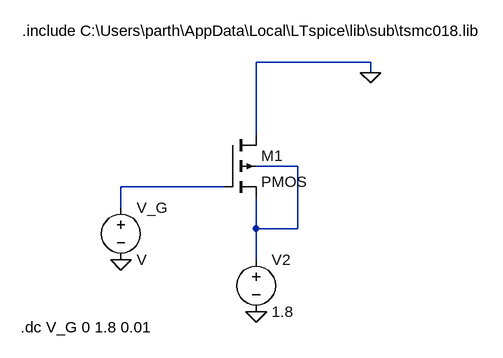
[diagram p0: schematic Part-A - a).asc]
Part-A - a).asc, the LTspice schematic file:
Version 4
SHEET 1 880 680
WIRE -768 -96 -944 -96
WIRE -768 -80 -768 -96
WIRE -944 16 -944 -96
WIRE -880 64 -944 64
WIRE -992 96 -1152 96
WIRE -1152 128 -1152 96
WIRE -944 160 -944 112
WIRE -880 160 -880 64
WIRE -880 160 -944 160
WIRE -944 208 -944 160
FLAG -944 288 0
FLAG -1152 208 0
FLAG -768 -80 0
SYMBOL pmos4 -992 16 R0
SYMATTR InstName M1
SYMATTR Value2 l=0.3204u w=17.8u
SYMBOL voltage -944 192 R0
WINDOW 123 0 0 Left 0
WINDOW 39 0 0 Left 0
SYMATTR InstName V2
SYMATTR Value 1.8
SYMBOL voltage -1152 112 R0
SYMATTR InstName V_G
TEXT -1304 -144 Left 2 !.include C:\\Users\\parth\\AppData\\Local\\LTspice\\lib\\sub\\tsmc018.lib
TEXT -1306 312 Left 2 !.dc V_G 0 1.8 0.01

The netlist it stands for:
* Part-A - a).asc
M1 0 N002 N001 N001 PMOS l=0.3204u w=17.8u
V2 N001 0 1.8
V_G N002 0 V
.model NMOS NMOS
.model PMOS PMOS
.lib standard.mos
.include C:\Users\parth\AppData\Local\LTspice\lib\sub\tsmc018.lib
.dc V_G 0 1.8 0.01
.backanno
.end

* Results of the author's LTspice run, read from the files saved beside the schematic
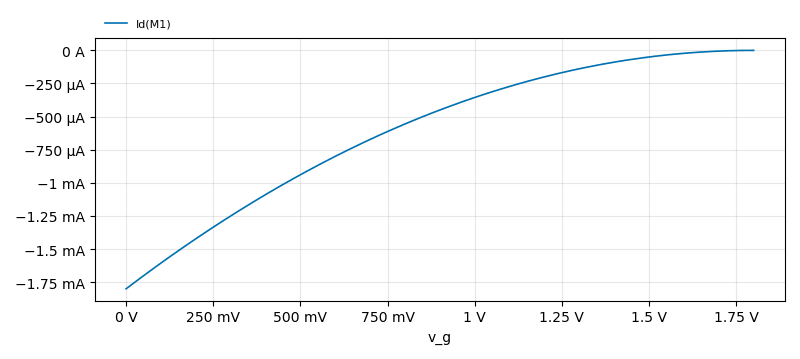
[diagram p1: DC transfer characteristic of Part-A - a).asc, plotted from the saved traces]
* DC transfer characteristic, 1 run:
*   Id(M1): -1.8 mA at v_g=0 V, -3.61 pA at v_g=1.8 V, min -1.8 mA, max -3.61 pA